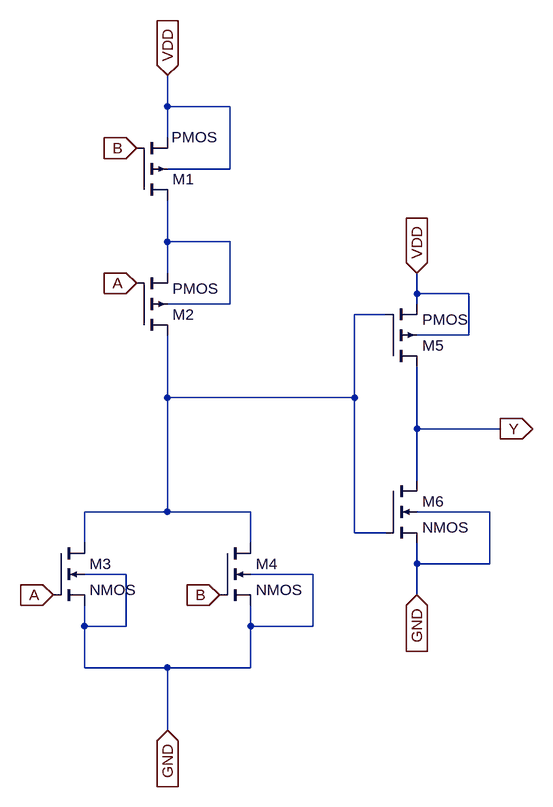
[diagram p0: schematic OR.asc]
OR.asc, the LTspice schematic file:
Version 4
SHEET 1 880 720
WIRE -64 -352 -64 -400
WIRE 32 -352 -64 -352
WIRE -64 -304 -64 -352
WIRE 32 -256 32 -352
WIRE 32 -256 -64 -256
WIRE -64 -144 -64 -208
WIRE 32 -144 -64 -144
WIRE -64 -96 -64 -144
WIRE 320 -64 320 -96
WIRE 400 -64 320 -64
WIRE 32 -48 32 -144
WIRE 32 -48 -64 -48
WIRE 320 -48 320 -64
WIRE 272 -32 224 -32
WIRE 400 0 400 -64
WIRE 400 0 320 0
WIRE -64 96 -64 0
WIRE 224 96 224 -32
WIRE 224 96 -64 96
WIRE 320 144 320 48
WIRE 448 144 320 144
WIRE 320 224 320 144
WIRE -64 272 -64 96
WIRE -64 272 -192 272
WIRE 64 272 -64 272
WIRE 432 272 320 272
WIRE 224 304 224 96
WIRE 272 304 224 304
WIRE -192 320 -192 272
WIRE 64 320 64 272
WIRE 320 352 320 320
WIRE 432 352 432 272
WIRE 432 352 320 352
WIRE -128 368 -192 368
WIRE 160 368 64 368
WIRE 320 400 320 352
WIRE -192 448 -192 416
WIRE -128 448 -128 368
WIRE -128 448 -192 448
WIRE 64 448 64 416
WIRE 160 448 160 368
WIRE 160 448 64 448
WIRE -192 512 -192 448
WIRE -64 512 -192 512
WIRE 64 512 64 448
WIRE 64 512 -64 512
WIRE -64 608 -64 512
FLAG -64 -400 VDD
IOPIN -64 -400 In
FLAG -240 400 A
IOPIN -240 400 In
FLAG 16 400 B
IOPIN 16 400 In
FLAG -112 -80 A
IOPIN -112 -80 In
FLAG -112 -288 B
IOPIN -112 -288 In
FLAG 320 -96 VDD
IOPIN 320 -96 In
FLAG 448 144 Y
IOPIN 448 144 Out
FLAG -64 608 GND
IOPIN -64 608 In
FLAG 320 400 GND
IOPIN 320 400 In
SYMBOL pmos4 -112 -208 M180
WINDOW 3 54 97 Left 2
SYMATTR InstName M1
SYMBOL pmos4 -112 0 M180
SYMATTR InstName M2
SYMBOL nmos4 -240 320 R0
SYMATTR InstName M3
SYMBOL nmos4 16 320 R0
SYMATTR InstName M4
SYMBOL pmos4 272 48 M180
SYMATTR InstName M5
SYMBOL nmos4 272 224 R0
SYMATTR InstName M6

The netlist it stands for:
* OR.asc
M1 N001 B VDD VDD PMOS
M2 N002 A N001 N001 PMOS
M3 N002 A GND GND NMOS
M4 N002 B GND GND NMOS
M5 Y N002 VDD VDD PMOS
M6 Y N002 GND GND NMOS
.model NMOS NMOS
.model PMOS PMOS
.lib standard.mos
.backanno
.end